# Altium schematic sheet bno08x_module.SchDoc
size A4; SheetNumber: 7; SheetTotal: 7
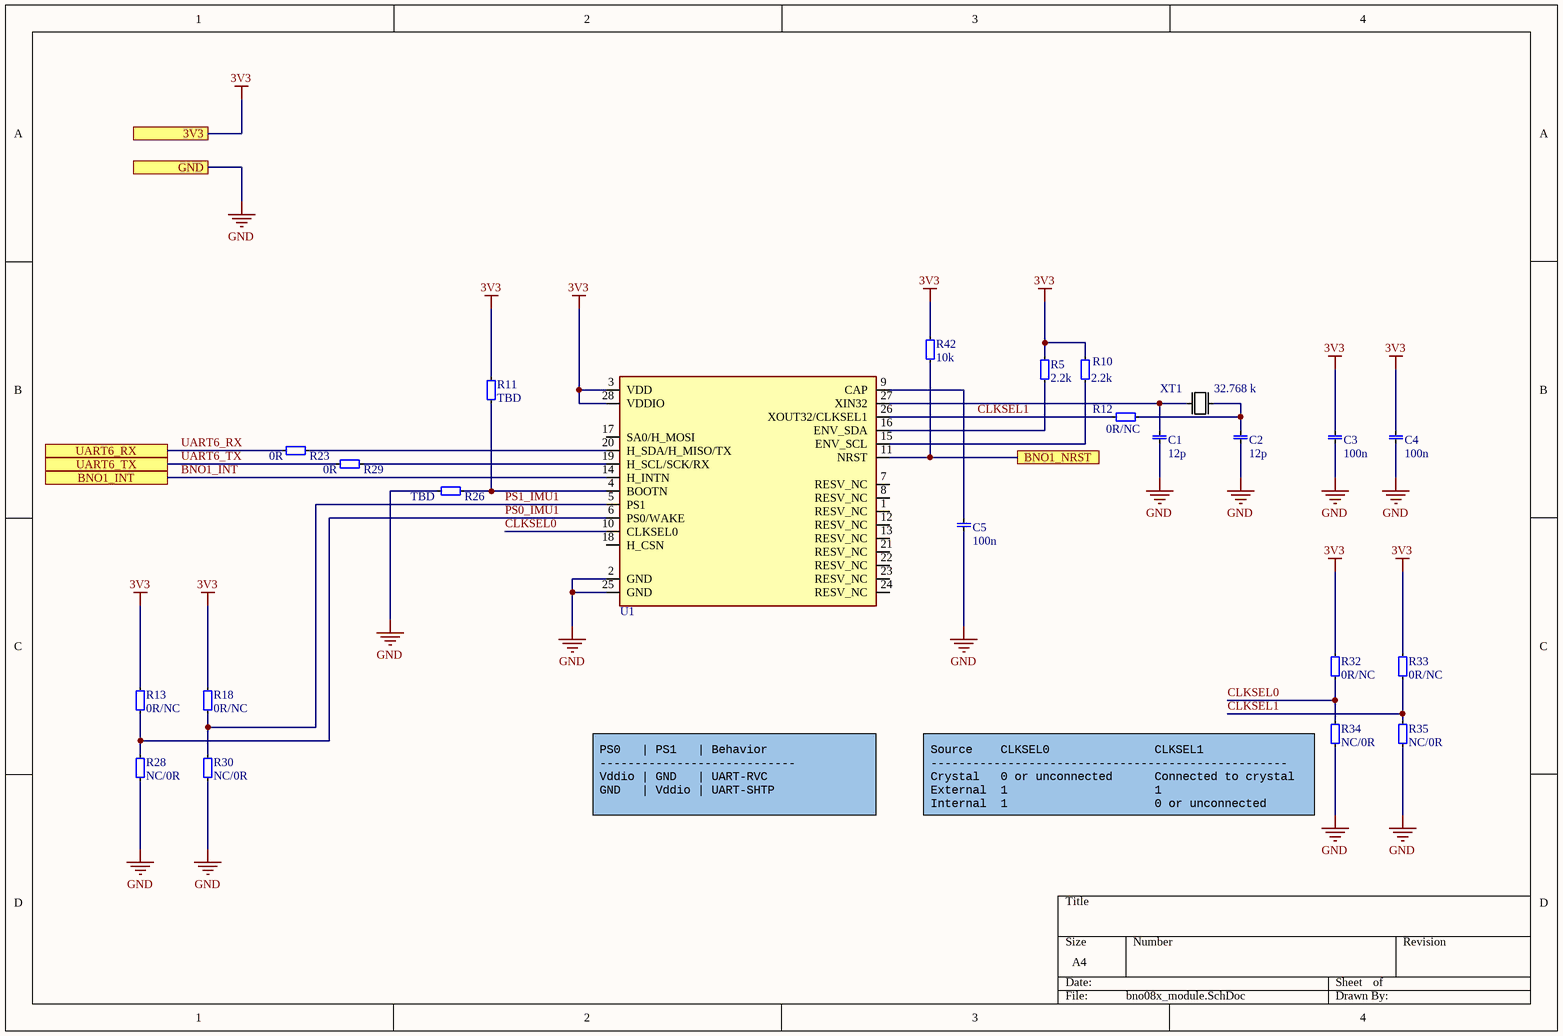
[diagram p0: bno08x_module.SchDoc]

## Parts
C1  value 12p  [0402 CAP]  (hidden comment: 0402 capacitor)
C2  value 12p  [0402 CAP]  (hidden comment: 0402 capacitor)
C3  value 100n  [0402 CAP]  (hidden comment: 0402 capacitor)
C4  value 100n  [0402 CAP]  (hidden comment: 0402 capacitor)
C5  value 100n  [0402 CAP]  (hidden comment: 0402 capacitor)
R5  value 2.2k  [0402 res]  (hidden comment: 0402, resistor)
R10  value 2.2k  [0402 res]  (hidden comment: 0402, resistor)
R11  value TBD  [0402 res]  (hidden comment: 0402, resistor)
R12  value 0R/NC  [0402 res]  (hidden comment: 0402, resistor)
R13  value 0R/NC  [0402 res]  (hidden comment: 0402, resistor)
R18  value 0R/NC  [0402 res]  (hidden comment: 0402, resistor)
R23  value 0R  [0402 res]  (hidden comment: 0402, resistor)
R26  value TBD  [0402 res]  (hidden comment: 0402, resistor)
R28  value NC/0R  [0402 res]  (hidden comment: 0402, resistor)
R29  value 0R  [0402 res]  (hidden comment: 0402, resistor)
R30  value NC/0R  [0402 res]  (hidden comment: 0402, resistor)
R32  value 0R/NC  [0402 res]  (hidden comment: 0402, resistor)
R33  value 0R/NC  [0402 res]  (hidden comment: 0402, resistor)
R34  value NC/0R  [0402 res]  (hidden comment: 0402, resistor)
R35  value NC/0R  [0402 res]  (hidden comment: 0402, resistor)
R42  value 10k  [0402 res]  (hidden comment: 0402, resistor)
U1  BNO08X  [LGA-28_2]  (value not drawn)
XT1  value 32.768 k  [ECS-.327-12.5-39-TR]  (hidden comment: Crystal)

## Ports
3V3, BNO1_INT, BNO1_NRST, GND, UART6_RX, UART6_TX

## Nets
3V3: C3.1 C4.1 R5.1 R10.1 R11.1 R13.0 R18.0 R32.0 R33.0 R42.1 U1.3(VDD) U1.28(VDDIO) ; port 3V3
GND: C1.0 C2.0 C3.0 C4.0 C5.0 R26.1 R28.1 R30.1 R34.1 R35.1 U1.2(GND) U1.25(GND) ; port GND
BNO1_INT: U1.14(H_INTN) ; port BNO1_INT
BNO1_NRST: R42.0 U1.11(NRST) ; port BNO1_NRST
CLKSEL0: R32.1 R34.0 U1.10(CLKSEL0)
CLKSEL1: R12.0 R33.1 R35.0 U1.26(XOUT32/CLKSEL1)
PS0_IMU1: R13.1 R28.0 U1.6(PS0/WAKE)
PS1_IMU1: R18.1 R30.0 U1.5(PS1)
UART6_RX: R23.1 ; port UART6_RX
UART6_TX: R29.1 ; port UART6_TX
NetC1_1: C1.1 U1.27(XIN32) XT1.1
NetC2_1: C2.1 R12.1 XT1.2
NetC5_1: C5.1 U1.9(CAP)
NetR5_0: R5.0 U1.16(ENV_SDA)
NetR10_0: R10.0 U1.15(ENV_SCL)
NetR11_0: R11.0 R26.0 U1.4(BOOTN)
NetR23_0: R23.0 U1.20(H_SDA/H_MISO/TX)
NetR29_0: R29.0 U1.19(H_SCL/SCK/RX)

Not connected (* = marked no-connect by the designer): U1 1(RESV_NC) 7(RESV_NC) 8(RESV_NC) 12(RESV_NC) 13(RESV_NC) 17(SA0/H_MOSI) 18(H_CSN) 21(RESV_NC) 22(RESV_NC) 23(RESV_NC) 24(RESV_NC)

## Notes on the sheet
- PS0   | PS1   | Behavior
  ----------------------------
  Vddio | GND   | UART-RVC
  GND   | Vddio | UART-SHTP
- (near R34) Source    CLKSEL0               CLKSEL1
  ---------------------------------------------------
  Crystal   0 or unconnected      Connected to crystal
  External  1                     1
  Internal  1                     0 or unconnected

## Library data of the parts
C1 C2 = 0402 capacitor: Manufacturer Part No: GJM1555C1H120JB01D
C3-C5 = 0402 capacitor: Manufacturer Part No: GRM155R62A104KE14D
R5 R10 = 0402, resistor: Manufacturer Part No: RC0402FR-072K2L
R12 R13 R18 R23 R28-R30 R32-R35 = 0402, resistor: Manufacturer Part No: RMCF0402ZT0R00
R42 = 0402, resistor: Manufacturer Part No: 311-10.0KLRCT-ND
U1 = BNO08X: 9-axis IMU; Manufacturer Part No: BNO085
XT1 = Crystal: Manufacturer Part No: CC4V-T1A-32.768KHZ-9PF-20PPM-TA-QC